# EAGLE design Foot_Controller (EAGLE 8.7.0)
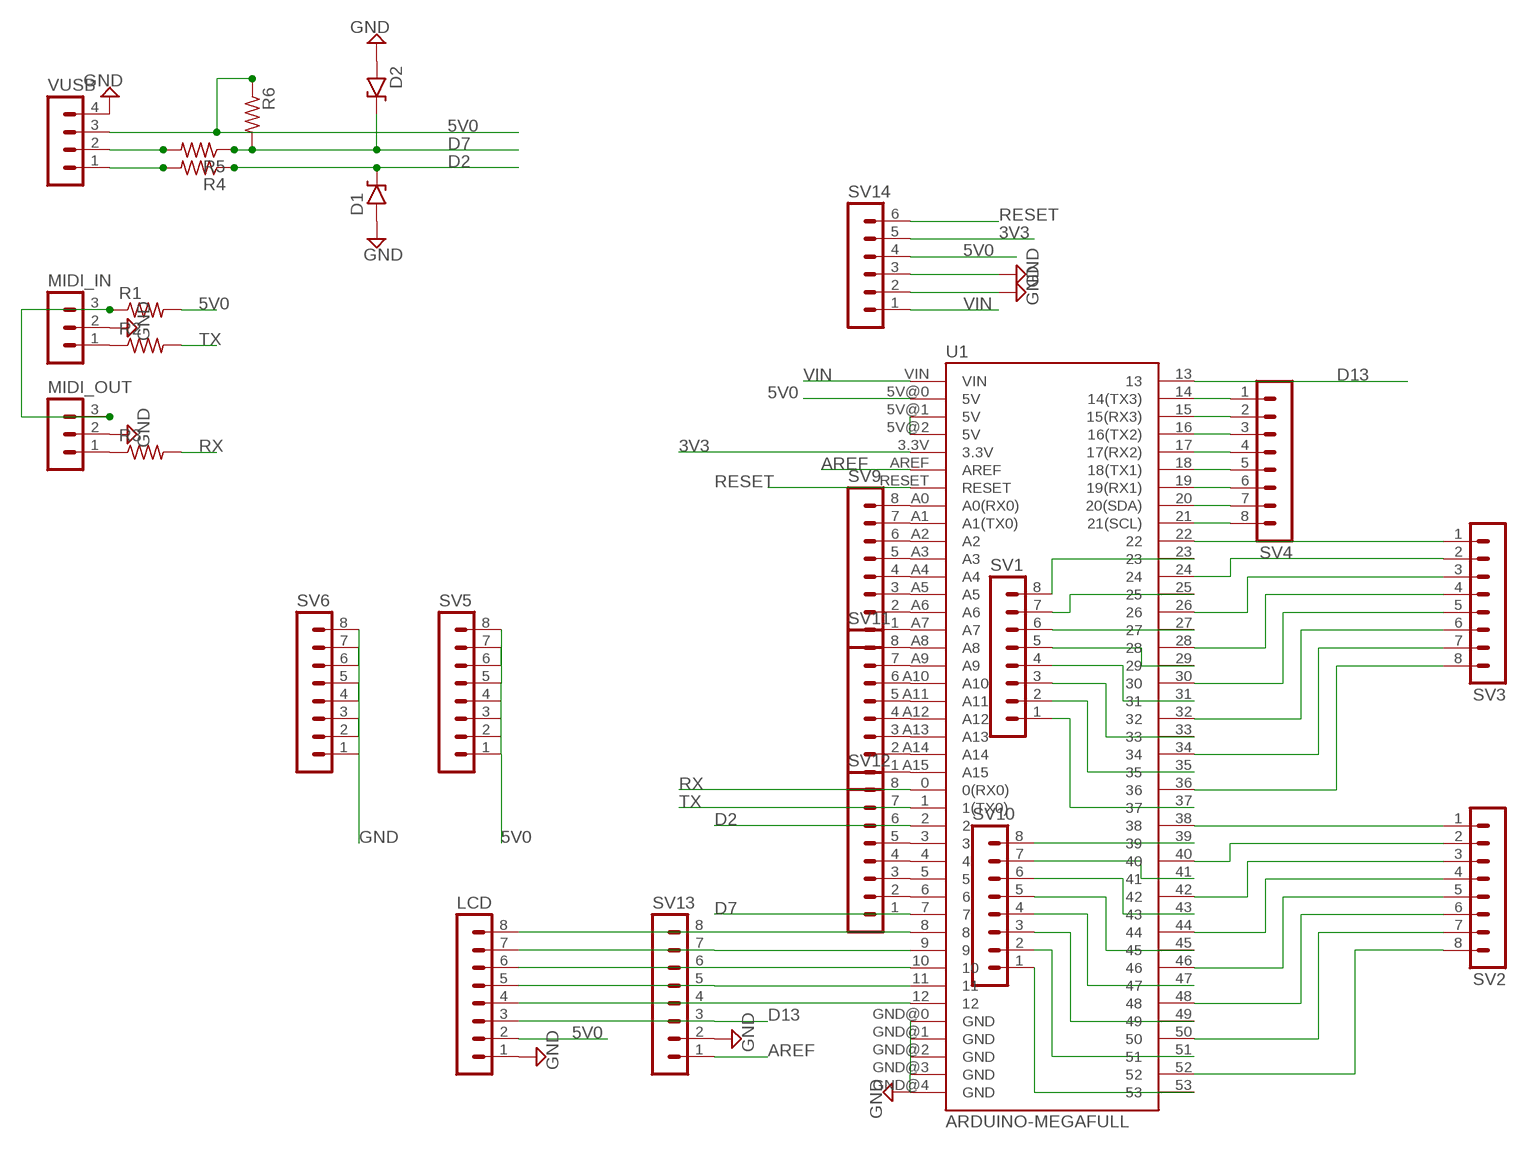
[diagram p0: schematic, sheet 1]

## Parts
D1  1N9ZENER  [DO35-3]
D2  1N9ZENER  [DO35-3]
LCD  MA08-1  [MA08-1]
MIDI_IN  MA03-1  [MA03-1]
MIDI_OUT  MA03-1  [MA03-1]
R1  6MM.3  [R0207/3]
R2  6MM.3  [R0207/3]
R3  6MM.3  [R0207/3]
R4  6MM.3  [R0207/3]
R5  6MM.3  [R0207/3]
R6  6MM.3  [R0207/3]
SV1  MA08-1  [MA08-1]
SV2  MA08-1  [MA08-1]
SV3  MA08-1  [MA08-1]
SV4  MA08-1  [MA08-1]
SV5  MA08-1  [MA08-1]
SV6  MA08-1  [MA08-1]
SV9  MA08-1  [MA08-1]
SV10  MA08-1  [MA08-1]
SV11  MA08-1  [MA08-1]
SV12  MA08-1  [MA08-1]
SV13  MA08-1  [MA08-1]
SV14  MA06-1  [MA06-1]
U1  ARDUINO-MEGAFULL  [ARDUINO_MEGA]
VUSB  MA04-1  [MA04-1]

## Nets
3V3: SV14.5 U1.3.3V
5V0: LCD.2 R1.2 R6.1 SV5.1 SV5.2 SV5.3 SV5.4 SV5.5 SV5.6 SV5.7 SV5.8 SV14.4 U1.5V@0(5V) VUSB.3
AREF: SV13.1 U1.AREF
D2: D1.C R4.1 SV12.6 U1.2
D7: D2.C R5.1 R6.2 SV12.1 U1.7
D13: LCD.3 SV13.3 U1.13
GND: D1.A D2.A LCD.1 MIDI_IN.2 MIDI_OUT.2 SV6.1 SV6.2 SV6.3 SV6.4 SV6.5 SV6.6 SV6.7 SV6.8 SV13.2 SV14.2 SV14.3 U1.GND@0(GND) U1.GND@1(GND) U1.GND@2(GND) U1.GND@3(GND) U1.GND@4(GND) VUSB.4
N$17: SV1.8 U1.23
N$18: SV1.7 U1.25
N$19: SV1.6 U1.27
N$20: SV1.5 U1.29
N$21: SV1.4 U1.31
N$22: SV1.3 U1.33
N$23: SV1.2 U1.35
N$24: SV1.1 U1.37
N$25: SV2.1 U1.38
N$26: SV2.2 U1.40
N$27: SV2.3 U1.42
N$28: SV2.4 U1.44
N$29: SV2.5 U1.46
N$30: SV2.6 U1.48
N$31: SV2.7 U1.50
N$32: SV2.8 U1.52
N$33: SV10.8 U1.39
N$34: SV10.7 U1.41
N$35: SV10.6 U1.43
N$36: SV10.5 U1.45
N$37: SV10.4 U1.47
N$38: SV10.3 U1.49
N$39: SV10.2 U1.51
N$40: SV10.1 U1.53
N$57: SV3.2 U1.24
N$58: SV3.1 U1.22
N$59: SV3.3 U1.26
N$60: SV3.4 U1.28
N$61: SV3.5 U1.30
N$62: SV3.6 U1.32
N$63: SV3.7 U1.34
N$64: SV3.8 U1.36
N$65: SV4.1 U1.14(14(TX3))
N$66: SV4.2 U1.15(15(RX3))
N$67: SV4.3 U1.16(16(TX2))
N$68: SV4.4 U1.17(17(RX2))
N$69: SV4.5 U1.18(18(TX1))
N$70: SV4.6 U1.19(19(RX1))
N$71: SV4.7 U1.20(20(SDA))
N$72: SV4.8 U1.21(21(SCL))
N$73: SV9.1 U1.A7
N$74: SV9.2 U1.A6
N$75: SV9.3 U1.A5
N$76: SV9.4 U1.A4
N$77: SV9.5 U1.A3
N$78: SV9.6 U1.A2
N$79: SV9.7 U1.A1(A1(TX0))
N$80: SV9.8 U1.A0(A0(RX0))
N$81: SV11.1 U1.A15
N$82: SV11.2 U1.A14
N$83: SV11.3 U1.A13
N$84: SV11.4 U1.A12
N$85: SV11.5 U1.A11
N$86: SV11.6 U1.A10
N$87: SV11.7 U1.A9
N$88: SV11.8 U1.A8
N$89: U1.5V@1(5V) U1.5V@2(5V)
N$90: SV12.2 U1.6
N$91: SV12.3 U1.5
N$92: SV12.4 U1.4
N$93: SV12.5 U1.3
N$97: LCD.8 SV13.8 U1.8
N$98: LCD.7 SV13.7 U1.9
N$99: LCD.6 SV13.6 U1.10
N$100: LCD.5 SV13.5 U1.11
N$101: LCD.4 SV13.4 U1.12
N$103: MIDI_OUT.1 R3.1
N$104: MIDI_IN.1 R2.1
N$105: MIDI_IN.3 MIDI_OUT.3 R1.1
N$107: R4.2 VUSB.1
N$108: R5.2 VUSB.2
RESET: SV14.6 U1.RESET
RX: R3.2 SV12.8 U1.0(0(RX0))
TX: R2.2 SV12.7 U1.1(1(TX0))
VIN: SV14.1 U1.VIN

## Library data of the parts
D1 D2 = mb_diodes:1N9*ZENER: 1N9???B Zener Diode DO-35 case 1N957B - 1N992B (6.8V to 200V)
LCD SV1-SV6 SV9-SV13 = con-lstb:MA08-1: PIN HEADER; OC_FARNELL: unknown; OC_NEWARK: unknown
MIDI_IN MIDI_OUT = con-lstb:MA03-1: PIN HEADER; OC_FARNELL: unknown; OC_NEWARK: unknown
R1-R6 = mb_resistors:6MM: 6mm Resistors Leads spaced 1-6 holes apart for 0.1" perfboard. Suitable for 1/4 watt resistors.
SV14 = con-lstb:MA06-1: PIN HEADER; OC_FARNELL: unknown; OC_NEWARK: unknown
U1 = SparkFun-Boards:ARDUINO-MEGA: Arduino Mega board footprint
VUSB = con-lstb:MA04-1: PIN HEADER; OC_FARNELL: unknown; OC_NEWARK: unknown

## Board
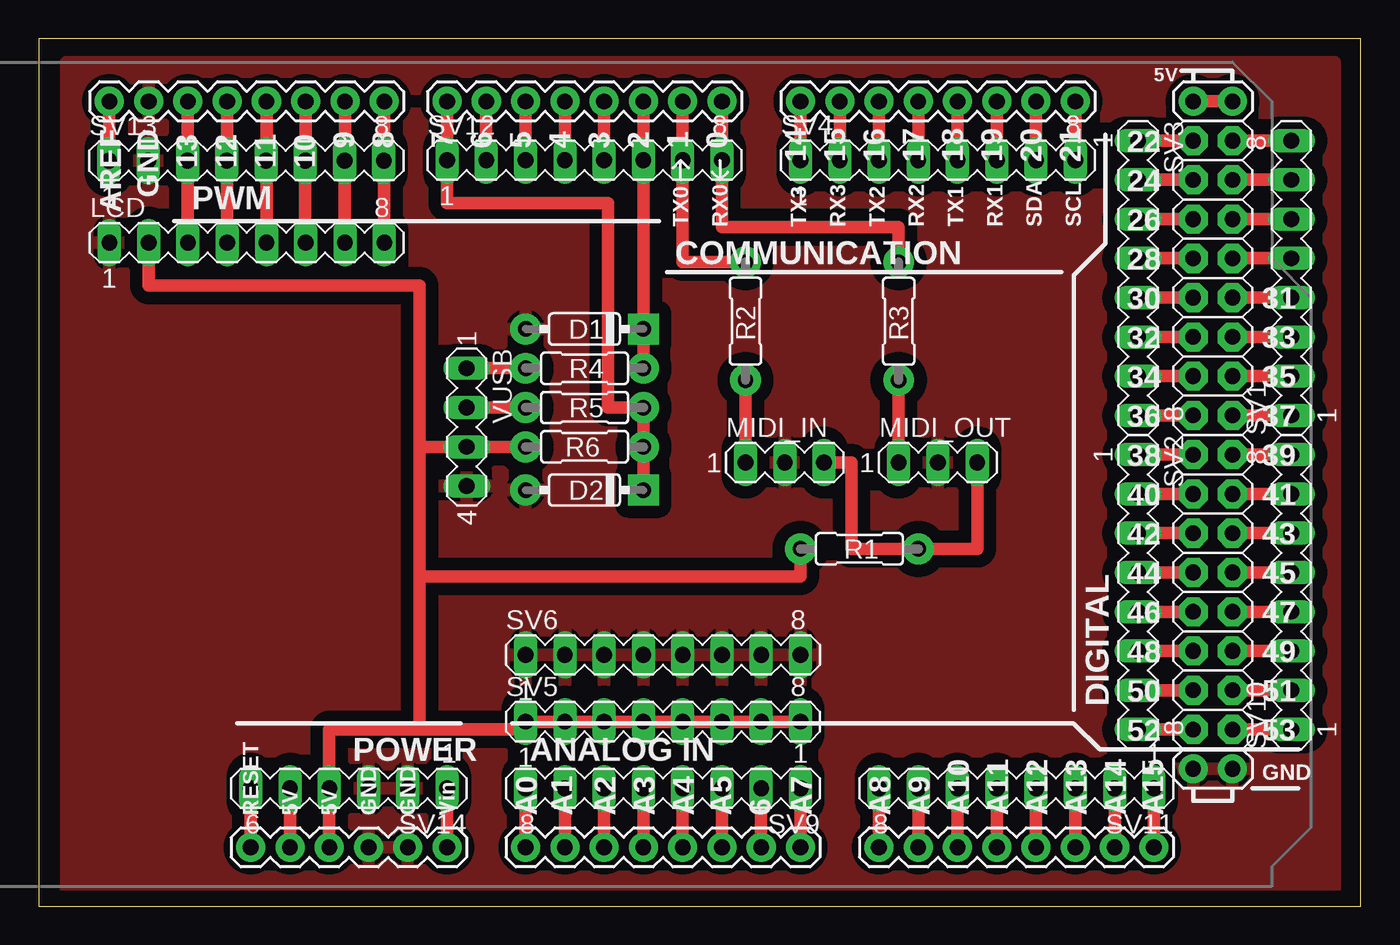
[diagram p1: board, top side]

Size 85.52 x 56.12 mm. Coordinates in mm from the lower left corner, seen from the top.
Outline: 0,0 85.52,0 85.52,56.12 0,56.12 0,0
Copper layers (1*16): Top 0.035mm / dielectric 1.5mm / Bottom 0.035mm
Design rules "default": minimum track width 6mil, minimum drill 0.35mm, track to track 6mil, track to pad 6mil, pad to pad 6mil, via to via 6mil, smd to smd 6mil, copper to edge 40mil, drill to drill 6mil, minimum pad ring 10mil, minimum via ring 8mil, stop-mask expansion 4mil, vias tented up to drill 0mil, thermal gap 10mil

### Footprints (pad centres in the part's own frame; a part is rotated, then mirrored left to right if it is on the bottom)
DO35-3 = drill 1 pad 2: A 3.81,0 | drill 1 pad 2 square: C -3.81,0
MA08-1 = drill 1.016 long: 1 -8.89,0; 2 -6.35,0; 3 -3.81,0; 4 -1.27,0; 5 1.27,0; 6 3.81,0; 7 6.35,0; 8 8.89,0
MA03-1 = drill 1.016 long: 1 -2.54,0; 2 0,0; 3 2.54,0
R0207/3 = drill 1 pad 2: 1 -3.81,0; 2 3.81,0
MA06-1 = drill 1.016 long: 1 -6.35,0; 2 -3.81,0; 3 -1.27,0; 4 1.27,0; 5 3.81,0; 6 6.35,0
ARDUINO_MEGA = drill 1.016 pad 1.88: 0 63.5,50.8; 1 60.96,50.8; 2 58.42,50.8; 3 55.88,50.8; 3.3V 35.56,2.54; 4 53.34,50.8; 5 50.8,50.8; 5V@0 38.1,2.54; 5V@1 93.98,50.8; 5V@2 96.52,50.8; 6 48.26,50.8; 7 45.72,50.8; 8 41.656,50.8; 9 39.116,50.8; 10 36.576,50.8; 11 34.036,50.8; 12 31.496,50.8; 13 28.956,50.8; 14 68.58,50.8; 15 71.12,50.8; 16 73.66,50.8; 17 76.2,50.8; 18 78.74,50.8; 19 81.28,50.8; 20 83.82,50.8; 21 86.36,50.8; A0 50.8,2.54; A1 53.34,2.54; A2 55.88,2.54; A3 58.42,2.54; A4 60.96,2.54; A5 63.5,2.54; A6 66.04,2.54; A7 68.58,2.54; A8 73.66,2.54; A9 76.2,2.54; A10 78.74,2.54; A11 81.28,2.54; A12 83.82,2.54; A13 86.36,2.54; A14 88.9,2.54; A15 91.44,2.54; AREF 23.876,50.8; GND@0 40.64,2.54; GND@1 43.18,2.54; GND@2 93.98,7.62; GND@3 96.52,7.62; GND@4 26.416,50.8; RESET 33.02,2.54; VIN 45.72,2.54 | drill 1.016 pad 1.88 octagon: 22 93.98,48.26; 23 96.52,48.26; 24 93.98,45.72; 25 96.52,45.72; 26 93.98,43.18; 27 96.52,43.18; 28 93.98,40.64; 29 96.52,40.64; 30 93.98,38.1; 31 96.52,38.1; 32 93.98,35.56; 33 96.52,35.56; 34 93.98,33.02; 35 96.52,33.02; 36 93.98,30.48; 37 96.52,30.48; 38 93.98,27.94; 39 96.52,27.94; 40 93.98,25.4; 41 96.52,25.4; 42 93.98,22.86; 43 96.52,22.86; 44 93.98,20.32; 45 96.52,20.32; 46 93.98,17.78; 47 96.52,17.78; 48 93.98,15.24; 49 96.52,15.24; 50 93.98,12.7; 51 96.52,12.7; 52 93.98,10.16; 53 96.52,10.16
MA04-1 = drill 1.016 long: 1 -3.81,0; 2 -1.27,0; 3 1.27,0; 4 3.81,0

### Placement (x,y rotation side)
D1  35.31,37.34 180 top
D2  35.31,26.92 180 top
LCD  13.46,42.93 0 top
MIDI_IN  48.26,28.7 0 top
MIDI_OUT  58.17,28.7 0 top
R1  53.09,23.11 180 top
R2  45.72,37.85 90 top
R3  55.63,37.85 90 top
R4  35.31,34.8 180 top
R5  35.31,32.26 180 top
R6  35.31,29.72 0 top
SV1  81.03,40.64 90 top
SV2  71.12,20.32 270 top
SV3  71.12,40.64 270 top
SV4  58.17,48.26 0 top
SV5  40.39,11.94 0 top
SV6  40.39,16.26 0 top
SV9  40.39,7.62 180 top
SV10  81.03,20.32 90 top
SV11  63.25,7.62 180 top
SV12  35.31,48.26 0 top
SV13  13.44,48.23 0 top
SV14  20.07,7.62 180 top
U1  -19.3,1.27 0 top
VUSB  27.69,30.99 270 top

### Tracks (layer width: path | path; a pad name or v marks a point on that pad's centre or on a via)
3V3
  Top 0.813: SV14.5 U1.3.3V
5V0
  Top 0.813: U1.5V@0 SV14.4 18.8,11.43 24.64,11.43 | R6.1 VUSB.3 24.64,29.72 | 24.64,29.72 24.64,40.13 7.11,40.13 LCD.2 | 24.64,11.43 24.64,21.34 | 24.64,21.34 24.64,29.72 | 24.64,21.34 49.28,21.34 R1.2 | 24.64,11.43 31.5,11.43 SV5.1 SV5.2 SV5.3 SV5.4 SV5.5 SV5.6 SV5.7 SV5.8
AREF
  Top 0.813: U1.AREF 4.57,48.23 SV13.1
D2
  Top 0.813: U1.2 SV12.6 D1.C R4.1
D7
  Top 0.813: U1.7 SV12.1 26.42,45.47 36.83,45.47 36.83,32.26 R5.1 R6.2 D2.C
D13
  Top 0.813: U1.13 9.63,52.07 SV13.3 9.65,48.23 LCD.3
GND
  pour Top (isolate 0.813): 1.78,54.61 83.82,54.61 83.82,0.76 1.78,0.76
N$17
  Top 0.813: SV1.8 U1.23
N$18
  Top 0.813: SV1.7 U1.25
N$19
  Top 0.813: SV1.6 U1.27
N$20
  Top 0.813: SV1.5 U1.29
N$21
  Top 0.813: SV1.4 U1.31
N$22
  Top 0.813: SV1.3 U1.33
N$23
  Top 0.813: SV1.2 U1.35
N$24
  Top 0.813: SV1.1 U1.37
N$25
  Top 0.813: SV2.1 U1.38
N$26
  Top 0.813: SV2.2 U1.40
N$27
  Top 0.813: SV2.3 U1.42
N$28
  Top 0.813: U1.44 SV2.4
N$29
  Top 0.813: U1.46 SV2.5
N$30
  Top 0.813: U1.48 SV2.6
N$31
  Top 0.813: U1.50 SV2.7
N$32
  Top 0.813: U1.52 SV2.8
N$33
  Top 0.813: U1.39 SV10.8
N$34
  Top 0.813: U1.41 SV10.7
N$35
  Top 0.813: U1.43 SV10.6
N$36
  Top 0.813: U1.45 SV10.5
N$37
  Top 0.813: U1.47 SV10.4
N$38
  Top 0.813: U1.49 SV10.3
N$39
  Top 0.813: U1.51 SV10.2
N$40
  Top 0.813: U1.53 SV10.1
N$57
  Top 0.813: U1.24 SV3.2
N$58
  Top 0.813: U1.22 SV3.1
N$59
  Top 0.813: U1.26 SV3.3
N$60
  Top 0.813: U1.28 SV3.4
N$61
  Top 0.813: SV3.5 U1.30
N$62
  Top 0.813: U1.32 SV3.6
N$63
  Top 0.813: SV3.7 U1.34
N$64
  Top 0.813: U1.36 SV3.8
N$65
  Top 0.813: U1.14 SV4.1
N$66
  Top 0.813: U1.15 SV4.2
N$67
  Top 0.813: U1.16 SV4.3
N$68
  Top 0.813: U1.17 SV4.4
N$69
  Top 0.813: U1.18 SV4.5
N$70
  Top 0.813: U1.19 SV4.6
N$71
  Top 0.813: U1.20 SV4.7
N$72
  Top 0.813: U1.21 SV4.8
N$73
  Top 0.813: SV9.1 U1.A7
N$74
  Top 0.813: SV9.2 U1.A6
N$75
  Top 0.813: SV9.3 U1.A5
N$76
  Top 0.813: SV9.4 U1.A4
N$77
  Top 0.813: SV9.5 U1.A3
N$78
  Top 0.813: SV9.6 U1.A2
N$79
  Top 0.813: SV9.7 U1.A1
N$80
  Top 0.813: SV9.8 U1.A0
N$81
  Top 0.813: SV11.1 U1.A15
N$82
  Top 0.813: SV11.2 U1.A14
N$83
  Top 0.813: SV11.3 U1.A13
N$84
  Top 0.813: SV11.4 U1.A12
N$85
  Top 0.813: SV11.5 U1.A11
N$86
  Top 0.813: SV11.6 U1.A10
N$87
  Top 0.813: SV11.7 U1.A9
N$88
  Top 0.813: U1.A8 SV11.8
N$89
  Top 0.813: U1.5V@2 U1.5V@1
N$90
  Top 0.813: U1.6 SV12.2
N$91
  Top 0.813: U1.5 SV12.3
N$92
  Top 0.813: SV12.4 U1.4
N$93
  Top 0.813: U1.3 SV12.5
N$97
  Top 0.813: U1.8 22.35,48.23 | SV13.8 22.35,48.23 | 22.35,48.23 LCD.8
N$98
  Top 0.813: U1.9 19.81,48.23 SV13.7 19.79,42.16 LCD.7
N$99
  Top 0.813: U1.10 17.27,48.23 SV13.6 17.25,42.16 LCD.6
N$100
  Top 0.813: U1.11 14.73,48.23 | SV13.5 14.73,48.23 | 14.73,48.23 LCD.5
N$101
  Top 0.813: U1.12 12.19,48.23 | SV13.4 12.19,48.23 | 12.19,48.23 LCD.4
N$103
  Top 0.813: MIDI_OUT.1 R3.1
N$104
  Top 0.813: R2.1 MIDI_IN.1
N$105
  Top 0.813: MIDI_OUT.3 60.71,23.11 R1.1 52.58,23.11 52.58,28.7 MIDI_IN.3
N$107
  Top 0.813: R4.2 VUSB.1
N$108
  Top 0.813: VUSB.2 R5.2
RESET
  Top 0.813: U1.RESET SV14.6
RX
  Top 0.813: U1.0 SV12.8 44.2,43.94 55.63,43.94 R3.2
TX
  Top 0.813: U1.1 SV12.7 41.66,41.66 R2.2
VIN
  Top 0.813: SV14.1 U1.VIN